# EAGLE design digital-Thermocouple (EAGLE 5.07)
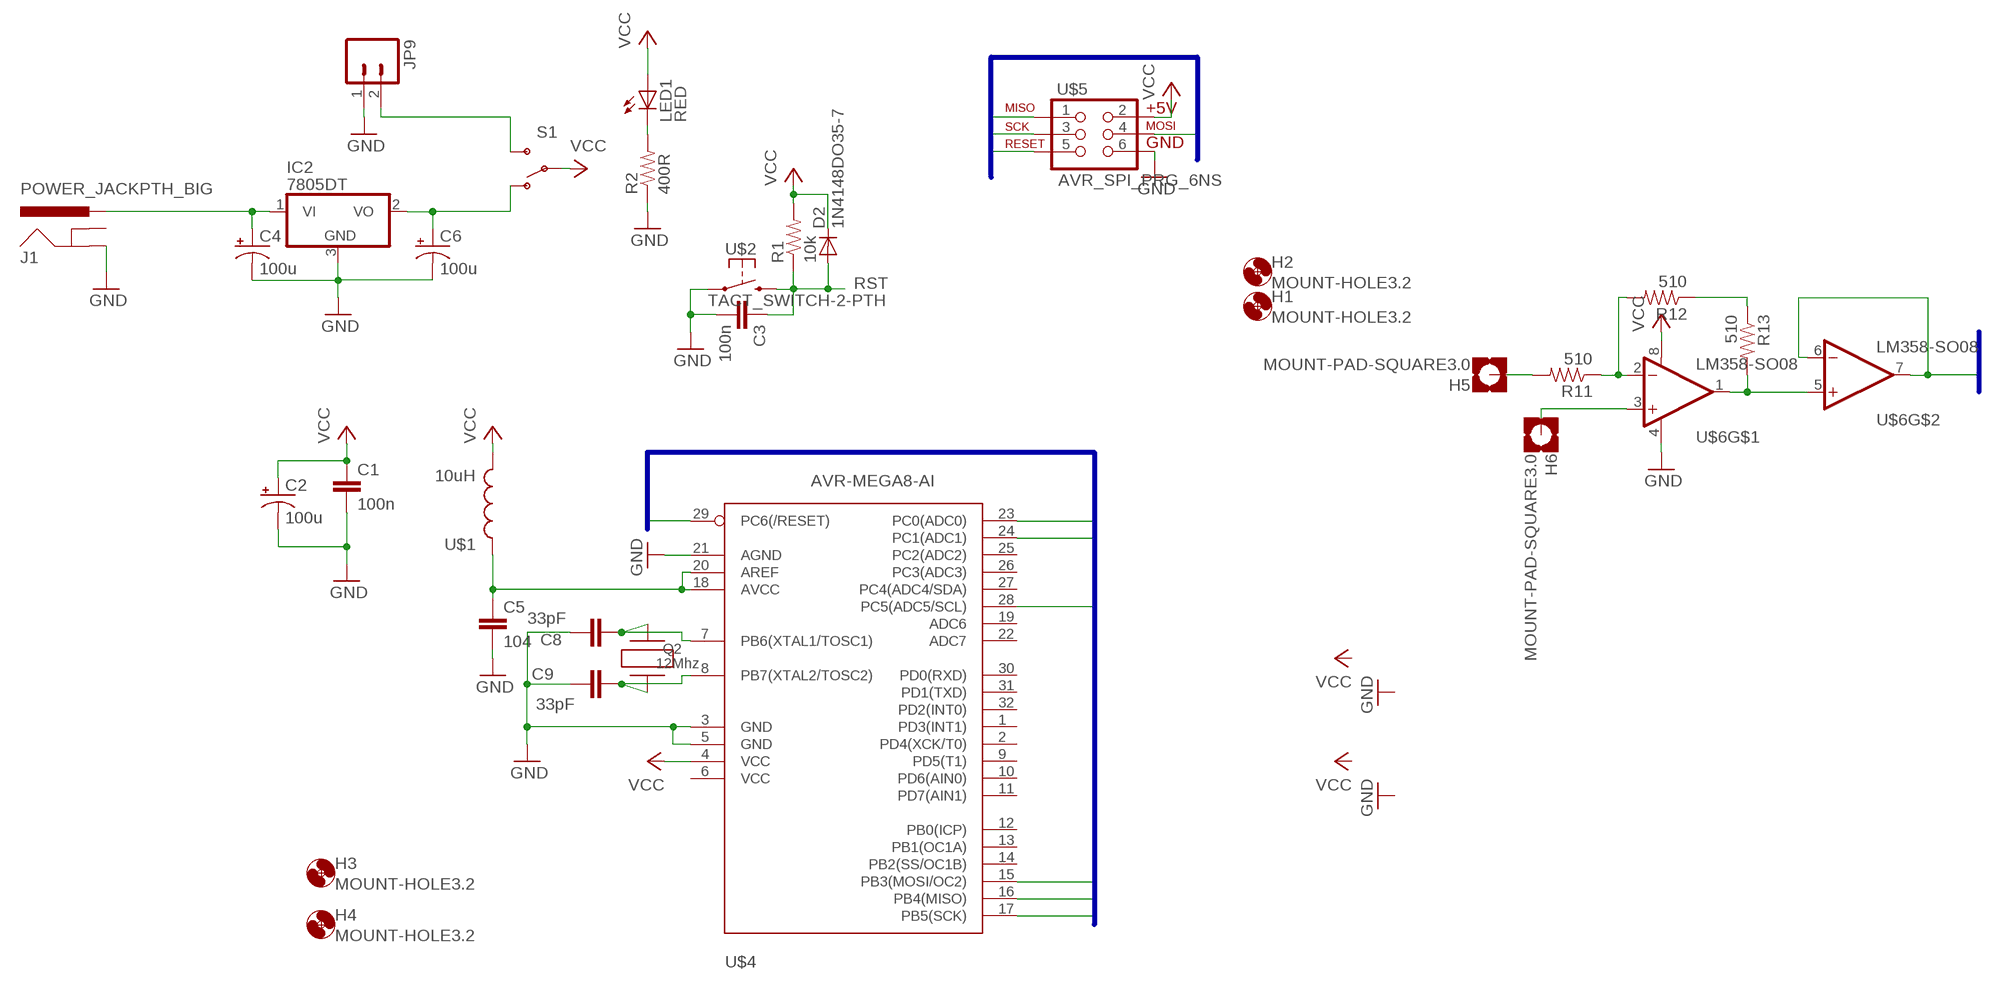
[diagram p0: schematic, sheet 1]

## Parts
C1  100n  CAP0805  [0805]
C2  100u  CAP_POLD  [PANASONIC_D]
C3  100n  CAP0805  [0805]
C4  100u  CAP_POLD  [PANASONIC_D]
C5  104  CAP0805  [0805]
C6  100u  CAP_POLD  [PANASONIC_D]
C8  33pF  CAP0805  [0805]
C9  33pF  CAP0805  [0805]
D2  1N4148DO35-7  DIODE1N4148  [DIODE-1N4148]
H1  MOUNT-HOLE3.2  [3,2]
H2  MOUNT-HOLE3.2  [3,2]
H3  MOUNT-HOLE3.2  [3,2]
H4  MOUNT-HOLE3.2  [3,2]
H5  MOUNT-PAD-SQUARE3.0  [3,0-PAD-SQUARE]
H6  MOUNT-PAD-SQUARE3.0  [3,0-PAD-SQUARE]
IC2  7805DT  [TO252]
J1  POWER_JACKPTH_BIG  [POWER_JACK_2.1X5.5_BIG_PTH]
JP9  CON-02-XH  [XH-1X2-LONG-LOCK]
LED1  RED  LEDCHIP-LED0805  [CHIP-LED0805]
Q2  12Mhz  XTAL  [XTAL]
R1  10k  RESISTOR0805  [0805]
R2  400R  RESISTOR0805  [0805]
R11  510  RESISTOR0805  [0805]
R12  510  RESISTOR0805  [0805]
R13  510  RESISTOR0805  [0805]
S1  SWITCH-SPST3AM6  [SWITCH-SPDT-AM#6]
U$1  10uH  INDUCTOR1/4W-SIZE  [0204/7]
U$2  TACT_SWITCH-2-PTH  [ALPS-SKHV]
U$4  AVR-MEGA8-AI  [TQFP32-08]
U$5  AVR_SPI_PRG_6NS  [2X3-NS]
U$6  LM358-SO08  [SO08]

## Nets
ADC5: U$4.28(PC5(ADC5/SCL)) U$6.6(-IN) U$6.7(OUT)
AVCC: C5.1 U$1.1 U$4.18(AVCC) U$4.20(AREF)
GND: C1.2 C2.- C3.2 C4.- C5.2 C6.- C8.2 C9.2 IC2.3(GND) J1.GND JP9.1 R2.1 U$2.2 U$4.3(GND) U$4.5(GND) U$4.21(AGND) U$5.6 U$6.4(V-)
MISO: U$4.16(PB4(MISO)) U$5.1
MOSI: U$4.15(PB3(MOSI/OC2)) U$5.4
N$1: C6.+ IC2.2(VO) S1.1(O)
N$2: C9.1 Q2.1 U$4.8(PB7(XTAL2/TOSC2))
N$3: JP9.2 S1.3(S)
N$4: LED1.C R2.2
N$5: C4.+ IC2.1(VI) J1.PWR
N$15: R13.2 U$6.1(OUT) U$6.5(+IN)
N$25: R12.1 R13.1
N$26: R11.1 R12.2 U$6.2(-IN)
N$27: H5.B3,0(MOUNT) R11.2
N$28: H6.B3,0(MOUNT) U$6.3(+IN)
N$34: C8.1 Q2.2 U$4.7(PB6(XTAL1/TOSC1))
PC0: U$4.23(PC0(ADC0))
PC1: U$4.24(PC1(ADC1))
RESET: U$4.29(PC6(/RESET)) U$5.5
RST: C3.1 D2.A R1.1 U$2.3
SCK: U$4.17(PB5(SCK)) U$5.3
VCC: C1.1 C2.+ D2.C LED1.A R1.2 S1.2(P) U$1.2 U$4.4(VCC) U$5.2 U$6.8(V+)
Unconnected: J1.GNDBREAK U$4.1(PD3(INT1)) U$4.2(PD4(XCK/T0)) U$4.6(VCC) U$4.9(PD5(T1)) U$4.10(PD6(AIN0)) U$4.11(PD7(AIN1)) U$4.12(PB0(ICP)) U$4.13(PB1(OC1A)) U$4.14(PB2(SS/OC1B)) U$4.19(ADC6) U$4.22(ADC7) U$4.25(PC2(ADC2)) U$4.26(PC3(ADC3)) U$4.27(PC4(ADC4/SDA)) U$4.30(PD0(RXD)) U$4.31(PD1(TXD)) U$4.32(PD2(INT0))

## Buses
B$1
B$2
B$5

## Library data of the parts
C1 C5 = SparkFun:CAP: Capacitor Standard 0603 ceramic capacitor, and 0.1" leaded capacitor.
C2 C4 C6 = digital-toy:CAP_POL: Capacitor Polarized These are standard SMD and PTH capacitors. Normally 10uF, 47uF, and 100uF in electrolytic and tantalum varieties. Always verify the external diameter of the through hole cap, it varies with capacity, voltage, and manufacturer. The EIA devices should be standard.
C3 C8 C9 = digital-toy:CAP: Capacitor Standard 0603 ceramic capacitor, and 0.1" leaded capacitor.
D2 = digital-toy:DIODE: Diode These are standard reverse protection diodes and small signal diodes. SMA package can handle up to about 1A. SOD-323 can handle about 200mA. What the SOD-323 package when ordering, there are some mfgs out there that are 5-pin packages.
H1-H4 = holes:MOUNT-HOLE: MOUNTING HOLE with drill center marker
H5 H6 = holes:MOUNT-PAD-SQUARE: MOUNTING PAD, square
IC2 = linear:78*: Positive VOLTAGE REGULATOR Source: http://cache.national.com/ds/LM/LM78L05.pdf http://www.fairchildsemi.com/ds/LM/LM7805.pdf
J1 = digital-toy:POWER_JACK: Power Jack This is the standard 5.5mm barrel jack for power. The PTH is the most common, proven, reliable, footprint. All others are experimental. The Slot footprint only works if the mill layer is transmitted to the PCB fab house so be warned. Spark Fun Electronics SKU : PRT-00119. Mating wall wart : TOL-00298 (and others)
JP9 = digital-toy:CON-02: Header 2 Standard 2-pin 0.1" header. Use with straight break away headers (SKU : PRT-00116), right angle break away headers (PRT-00553), swiss pins (PRT-00743), machine pins (PRT-00117), and female headers (PRT-00115). Molex polarized connector foot print use with SKU : PRT-08233 with associated crimp pins and housings.
LED1 = led:LED: LED OSRAM: - CHIPLED LG R971, LG N971, LY N971, LG Q971, LY Q971, LO R971, LY R971 LH N974, LH R974 LS Q976, LO Q976, LY Q976 LO Q996 - Hyper CHIPLED LW Q18S LB Q993, LB Q99A, LB R99A - SideLED LS A670, LO A670, LY A670, LG A670, LP A670 LB A673, LV A673, LT A673, LW A673 LH A674 LY A675 LS A676, LA A676, LO A676, LY A676, LW A676 LS A679, LY A679, LG A679 - Hyper Micro SIDELED® LS Y876, LA Y876, LO Y876, LY Y876 LT Y87S - SmartLED LW L88C, LW L88S LB L89C, LB L89S, LG L890 LS L89K, LO L89K, LY L89K LS L896, LA L896, LO L896, LY L896 - TOPLED LS T670, LO T670, LY T670, LG T670, LP T670 LSG T670, LSP T670, LSY T670, LOP T670, LYG T670 LG T671, LOG T671, LSG T671 LB T673, LV T673, LT T673, LW T673 LH T674 LS T676, LA T676, LO T676, LY T676, LB T676, LH T676, LSB T676, LW T676 LB T67C, LV T67C, LT T67C, LS T67K, LO T67K, LY T67K, LW E67C LS E67B, LA E67B, LO E67B, LY E67B, LB E67C, LV E67C, LT E67C LW T67C LS T679, LY T679, LG T679 LS T770, LO T770, LY T770, LG T770, LP T770 LB T773, LV T773, LT T773, LW T773 LH T774 LS E675, LA E675, LY E675, LS T675 LS T776, LA T776, LO T776, LY T776, LB T776 LHGB T686 LT T68C, LB T68C - Hyper Mini TOPLED® LB M676 - Mini TOPLED Santana® LG M470 LS M47K, LO M47K, LY M47K Source: http://www.osram.convergy.de LUXEON: - LUMILED® LXK2-PW12-R00, LXK2-PW12-S00, LXK2-PW14-U00, LXK2-PW14-V00 LXK2-PM12-R00, LXK2-PM12-S00, LXK2-PM14-U00 LXK2-PE12-Q00, LXK2-PE12-R00, LXK2-PE12-S00, LXK2-PE14-T00, LXK2-PE14-U00 LXK2-PB12-K00, LXK2-PB12-L00, LXK2-PB12-M00, LXK2-PB14-N00, LXK2-PB14-P00, LXK2-PB14-Q00 LXK2-PR12-L00, LXK2-PR12-M00, LXK2-PR14-Q00, LXK2-PR14-R00 LXK2-PD12-Q00, LXK2-PD12-R00, LXK2-PD12-S00 LXK2-PH12-R00, LXK2-PH12-S00 LXK2-PL12-P00, LXK2-PL12-Q00, LXK2-PL12-R00 Source: www.luxeon.com KINGBRIGHT: KA-3528ASYC Source: www.kingbright.com
Q2 = yhf_spec-RF:XTAL
R1 R2 R11-R13 = digital-toy:RESISTOR: Resistor Basic schematic elements and footprints for 0603, 1206, and PTH 1/10th watt (small) resistors.
S1 = digital-toy:SWITCH-SPST: SPST Switch Simple slide switch. Spark Fun Electronics SKU : COM-00102
U$1 = digital-toy:INDUCTOR: Inductors Basic Inductor/Choke - 0603 and 1206. Footprints are not proven and vary greatly between part numbers.
U$2 = digital-toy:TACT_SWITCH-2
U$4 = SparkFun:AVR-MEGA8: MICROCONTROLLER 8 Kbytes FLASH 1 kbytes SRAM 512 bytes EEPROM USART 6-channel 10 bit ADC 2-channel 8 bit ADC
U$5 = digital-toy:AVR_SPI_PRG_6: AVR ISP 6 Pin This is the reduced ISP connector for AVR programming. Common on Arduino. This footprint will take up less PCB space and can be used with a 10-pin to 6-pin adapter such as SKU: BOB-08508
U$6 = digital-toy:LM358

## Board
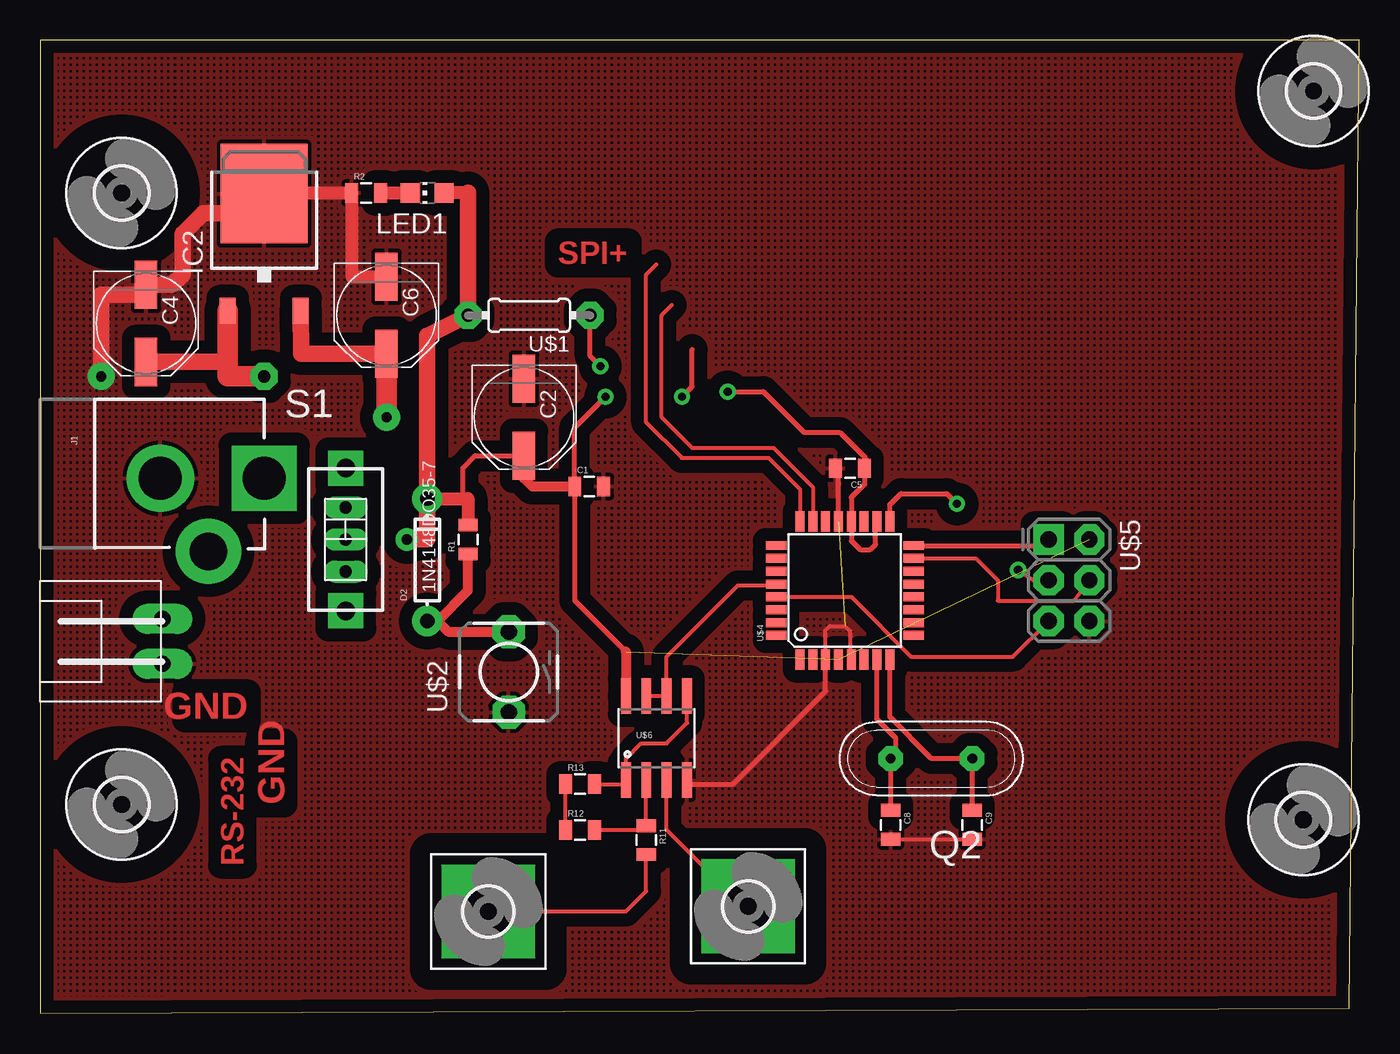
[diagram p1: board, top side]
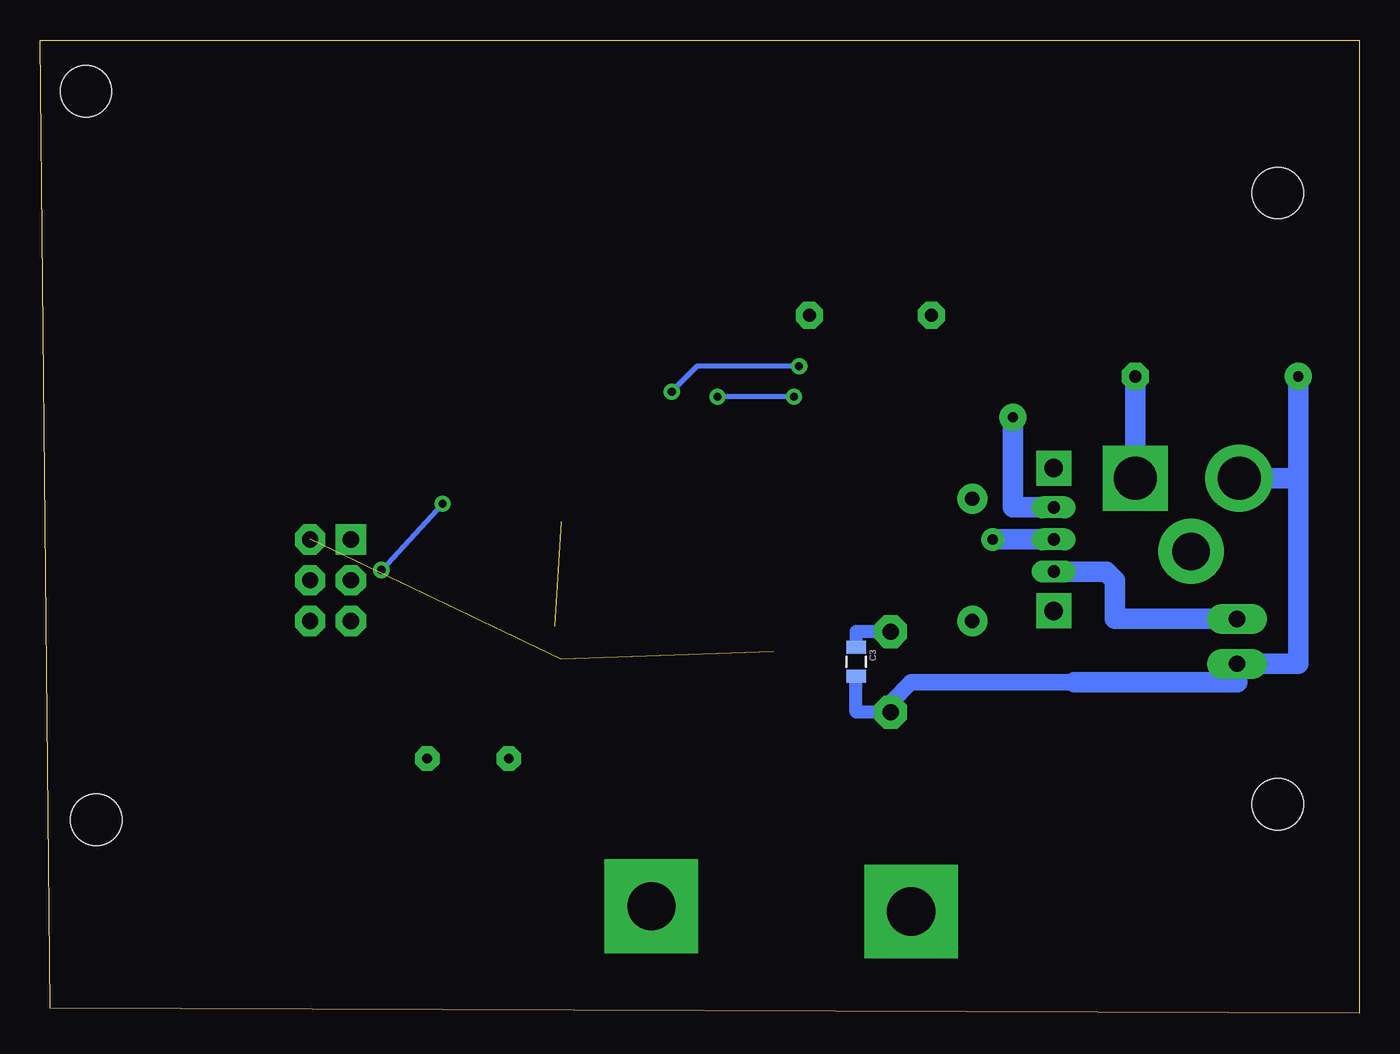
[diagram p2: board, bottom side, seen from below]

Size 82.23 x 60.64 mm. Coordinates in mm from the lower left corner, seen from the top.
Outline: 0,0 81.6,0.32 82.23,60.64 0,60.64 0,0
Copper layers (1*16): Top 0.035mm / dielectric 1.5mm / Bottom 0.035mm
Design rules "SparkFun": minimum track width 8mil, minimum drill 20mil, track to track 8mil, track to pad 8mil, pad to pad 8mil, via to via 8mil, smd to smd 8mil, copper to edge 10mil, drill to drill 8mil, minimum pad ring 12mil, minimum via ring 10mil, stop-mask expansion 4mil, vias tented up to drill 25mil, thermal gap 10mil

### Footprints (pad centres in the part's own frame; a part is rotated, then mirrored left to right if it is on the bottom)
0805 = smd 0.8 x 1.2: 1 -0.9,0; 2 0.9,0
PANASONIC_D = smd 3 x 1.4: + 2.4,0; - -2.4,0
DIODE-1N4148 = drill 0.9 pad 1.88 round: A -3.81,0; C 3.81,0
3,2 = hole 3.2: 0,0
3,0-PAD-SQUARE = drill 3 pad 5.842 square: B3,0 0,0
TO252 = smd 1 x 1.6: 1 -2.28,-4.8; 2 2.28,-4.8 | smd 5.4 x 6.2: 3 0,2.5
POWER_JACK_2.1X5.5_BIG_PTH = drill 2.667 pad 4.191 round: GND 0,-0.127 | drill 2.337 pad 4.064 round: GNDBREAK 4.547,2.87 | drill 2.667 pad 4.064 square: PWR 0,6.35
XH-1X2-LONG-LOCK = drill 1.016 pad 1.88 long: 1 -1.397,0; 2 1.397,0
CHIP-LED0805 = smd 1.2 x 1.2: A 0,-1.05; C 0,1.05
XTAL = drill 0.61 pad 1.524 octagon: 1 -2.54,0; 2 2.54,0
SWITCH-SPDT-AM#6 = drill 0.762 pad 1.27 long: 1 0,2; 2 0,0; 3 0,-2 | drill 1.15 pad 2.184 square: P$1 0,-4.445; P$2 0,4.445
0204/7 = drill 0.813 pad 1.676 octagon: 1 -3.81,0; 2 3.81,0
ALPS-SKHV = drill 1.016 pad 2.032 octagon: 2 -2.51,0; 3 2.51,0
TQFP32-08 = smd 1.27 x 0.559: 1 -4.293,2.8; 2 -4.293,2; 3 -4.293,1.2; 4 -4.293,0.4; 5 -4.293,-0.4; 6 -4.293,-1.2; 7 -4.293,-2; 8 -4.293,-2.8; 17 4.293,-2.8; 18 4.293,-2; 19 4.293,-1.2; 20 4.293,-0.4; 21 4.293,0.4; 22 4.293,1.2; 23 4.293,2; 24 4.293,2.8 | smd 0.559 x 1.27: 9 -2.8,-4.293; 10 -2,-4.293; 11 -1.2,-4.293; 12 -0.4,-4.293; 13 0.4,-4.293; 14 1.2,-4.293; 15 2,-4.293; 16 2.8,-4.293; 25 2.8,4.293; 26 2,4.293; 27 1.2,4.293; 28 0.4,4.293; 29 -0.4,4.293; 30 -1.2,4.293; 31 -2,4.293; 32 -2.8,4.293
2X3-NS = drill 1.016 pad 1.88 square: 1 -2.54,-1.27 | drill 1.016 pad 1.88 octagon: 2 -2.54,1.27; 3 0,-1.27; 4 0,1.27; 5 2.54,-1.27; 6 2.54,1.27
SO08 = smd 0.61 x 2.21: 1 -1.905,-2.616; 2 -0.635,-2.616; 3 0.635,-2.616; 4 1.905,-2.616; 5 1.905,2.616; 6 0.635,2.616; 7 -0.635,2.616; 8 -1.905,2.616

### Placement (x,y rotation side)
C1  34.23,32.83 0 top
C2  30.16,37.15 270 top
C3  31.37,21.91 270 bottom
C4  6.6,42.99 270 top
C5  50.48,33.97 180 top
C6  21.59,43.5 270 top
C8  53.02,11.75 270 top
C9  58.1,11.75 270 top
D2  24.13,28.26 90 top
H1  5.08,51.12 0 top
H2  79.38,57.47 0 top
H3  78.74,12.06 0 top
H4  5.08,13.02 0 top
H5  27.94,6.35 0 top
H6  44.13,6.67 0 top
IC2  13.97,48.58 0 top
J1  7.62,33.34 270 top
JP9  7.62,23.18 90 top
LED1  24.13,51.12 90 top
Q2  55.56,15.88 180 top
R1  26.67,29.53 90 top
R2  20.32,51.12 0 top
R11  37.78,10.79 270 top
R12  33.65,11.43 0 top
R13  33.65,14.29 0 top
S1  19.05,29.53 0 top
U$1  30.48,43.5 180 top
U$2  29.21,21.27 90 top
U$4  50.16,26.35 90 top
U$5  64.14,26.99 270 top
U$6  38.42,17.14 0 top

### Tracks (layer width: path | path; a pad name or v marks a point on that pad's centre or on a via)
ADC5
  Top 0.254: U$4.28 45.79,26.67 43.5,26.67 39.05,22.23 U$6.6 U$6.7
AVCC  (via drill 0.51)
  Top 0.305: U$4.18 52.07,30.55 52.07,29.21 51.75,28.89 51.12,28.89 50.57,29.45 U$4.20 50.57,32.15 51.38,32.97 C5.1 51.43,34.02 51.43,34.61 49.85,36.2 47.63,36.2 45.09,38.73 v42.86,38.73 | U$1.1 34.29,40.96 v34.92,40.32
  Bottom 0.305: v34.92,40.32 41.28,40.32 v42.86,38.73
GND  (via drill 0.64 pad 1.68)  (1 unrouted)
  Top 0.254: U$4.3 48.96,23.88 49.21,24.13 50.17,24.13 50.48,23.81 50.48,22.14 U$4.5 | C8.2 C9.2
  Top 0.305: U$4.21 49.77,33.79 C5.2 | U$4.3 48.96,20.07 43.18,14.29 40.56,14.29 U$6.4
  Top 0.61: IC2.3 12.7,52.02 | 6.6,44.77 C4.-
  Top 0.813: 12.7,52.02 12.7,51.12 | IC2.3 13.97,51.12 R2.1 19.42,45.91 C6.-
  Top 1.016: v3.81,39.69 3.81,44.77 6.6,44.77 | C4.- 8.24,45.39 8.89,46.04 8.89,48.58 10.16,49.85 12.74,49.85 IC2.3
  Bottom 0.813: C3.2 31.37,18.76 U$2.2 29.21,19.37
  Bottom 1.016: 29.21,19.37 27.94,20.64 17.78,20.64
  Bottom 1.27: 17.78,20.64 7.62,20.64 JP9.1 3.81,21.78 3.81,33.34 | 3.81,33.34 J1.GND | 3.81,33.34 v3.81,39.69
  pour Top (isolate 0.813, hatched): -13.65,59.05 -13.02,59.05 -6.35,65.72 82.55,65.72 87.63,60.64 87.63,-5.4 82.55,-10.48 -13.02,-10.48 -23.81,0.32 -23.81,49.21 -13.97,59.05
MISO
  Top 0.305: U$4.16 62.49,29.15 U$5.1
MOSI
  Top 0.254: U$4.15 58.32,28.35 59.69,26.99 59.69,25.72 64.45,25.72 U$5.4
N$1  (via drill 0.64 pad 1.68)
  Top 1.016: IC2.2 16.26,41.11 C6.+
  Top 1.27: v21.59,37.15 C6.+
  Bottom 1.27: S1.1 21.59,31.53 v21.59,37.15
N$2
  Top 0.305: U$4.8 52.96,18.47 55.56,15.88 Q2.1 C9.1
N$3
  Bottom 1.27: JP9.2 15.24,24.57 15.24,26.99 15.78,27.53 S1.3
N$4
  Top 0.813: R2.2 LED1.C
N$5  (via drill 0.76 pad 1.68)
  Top 0.61: 11.32,40.59 11.69,40.96
  Top 1.016: C4.+ 11.32,40.59
  Top 1.27: v13.97,39.69 11.68,39.71 11.69,40.96 IC2.1
  Bottom 1.27: v13.97,39.69 J1.PWR
N$15
  Top 0.254: R13.2 36.27,14.29 U$6.1 36.51,15.88 37.46,16.83 39.05,16.83 40.32,18.1 U$6.5
N$25
  Top 0.254: R12.1 R13.1
N$26
  Top 0.254: R12.2 37.52,11.43 R11.1 U$6.2
N$27
  Top 0.254: R11.2 37.78,7.62 36.51,6.35 H5.B3,0
N$28
  Top 0.254: U$6.3 39.05,11.43 41.59,8.89 41.59,7.62 H6.B3,0
N$34
  Top 0.305: U$4.7 52.17,18.32 53.34,17.14 53.34,16.19 Q2.2 C8.1
PC0
  Top 0.254: U$4.23 48.17,32.8 45.72,35.24 40.64,35.24 38.74,37.15 38.74,43.5 39.37,44.13
PC1
  Top 0.254: U$4.24 47.36,32.65 45.4,34.61 40,34.61 37.78,36.83 37.78,46.04 38.42,46.67
RESET
  Top 0.254: U$4.29 50.57,25.95 54.29,22.23 60.64,22.23 U$5.5
RST
  Top 0.61: D2.A 24.76,24.45 | 24.76,24.45 26.67,26.35 R1.1 | U$2.3 25.43,23.78 24.76,24.45
  Bottom 0.813: U$2.3 31.37,23.78 C3.1
SCK  (via drill 0.51)
  Top 0.254: v60.96,27.62 61.91,26.99 U$5.3
  Top 0.305: U$4.17 52.96,31.69 53.66,32.38 56.52,32.38 v57.15,31.75
  Bottom 0.305: v57.15,31.75 v60.96,27.62
VCC  (via drill 0.51, 0.64 pad 1.42)  (2 unrouted)
  Top 0.305: C2.+ 27.13,34.75 26.35,33.97 26.35,32.07 | 36.51,22.54 33.33,25.73 C1.1 33.33,36.5 v35.24,38.42 | v40,38.42 40.64,39.05 40.64,41.38
  Top 0.61: 36.51,22.54 U$6.8 | C1.1 30.67,32.83 30.16,33.34 C2.+
  Top 0.813: R1.2 26.67,32.07 26.35,32.07 D2.C | 26.67,51.12 LED1.A
  Top 1.016: 26.67,51.12 U$1.2 24.13,42.23 D2.C 24.13,29.53 v22.86,29.53
  Bottom 0.305: v35.24,38.42 v40,38.42
  Bottom 1.27: S1.2 v22.86,29.53

### Text on the board
Top: SPI+ | GND | GND | RS-232
Document: AREF | GND | PB5 | PB4 | PB3 | PB2 | PB1 | PB0 | PD7 | PD6 | PD5 | PD4 | PD3 | PD2 | PD1 | PD0 | !Reset | +3V3 | +5V | GND | GND | +Vin | PC0 | PC1 | PC2 | PC3 | PC4 | PC5